# EAGLE design 3w-rgb-led-connector-mk-7.0 (EAGLE 6.5.0)
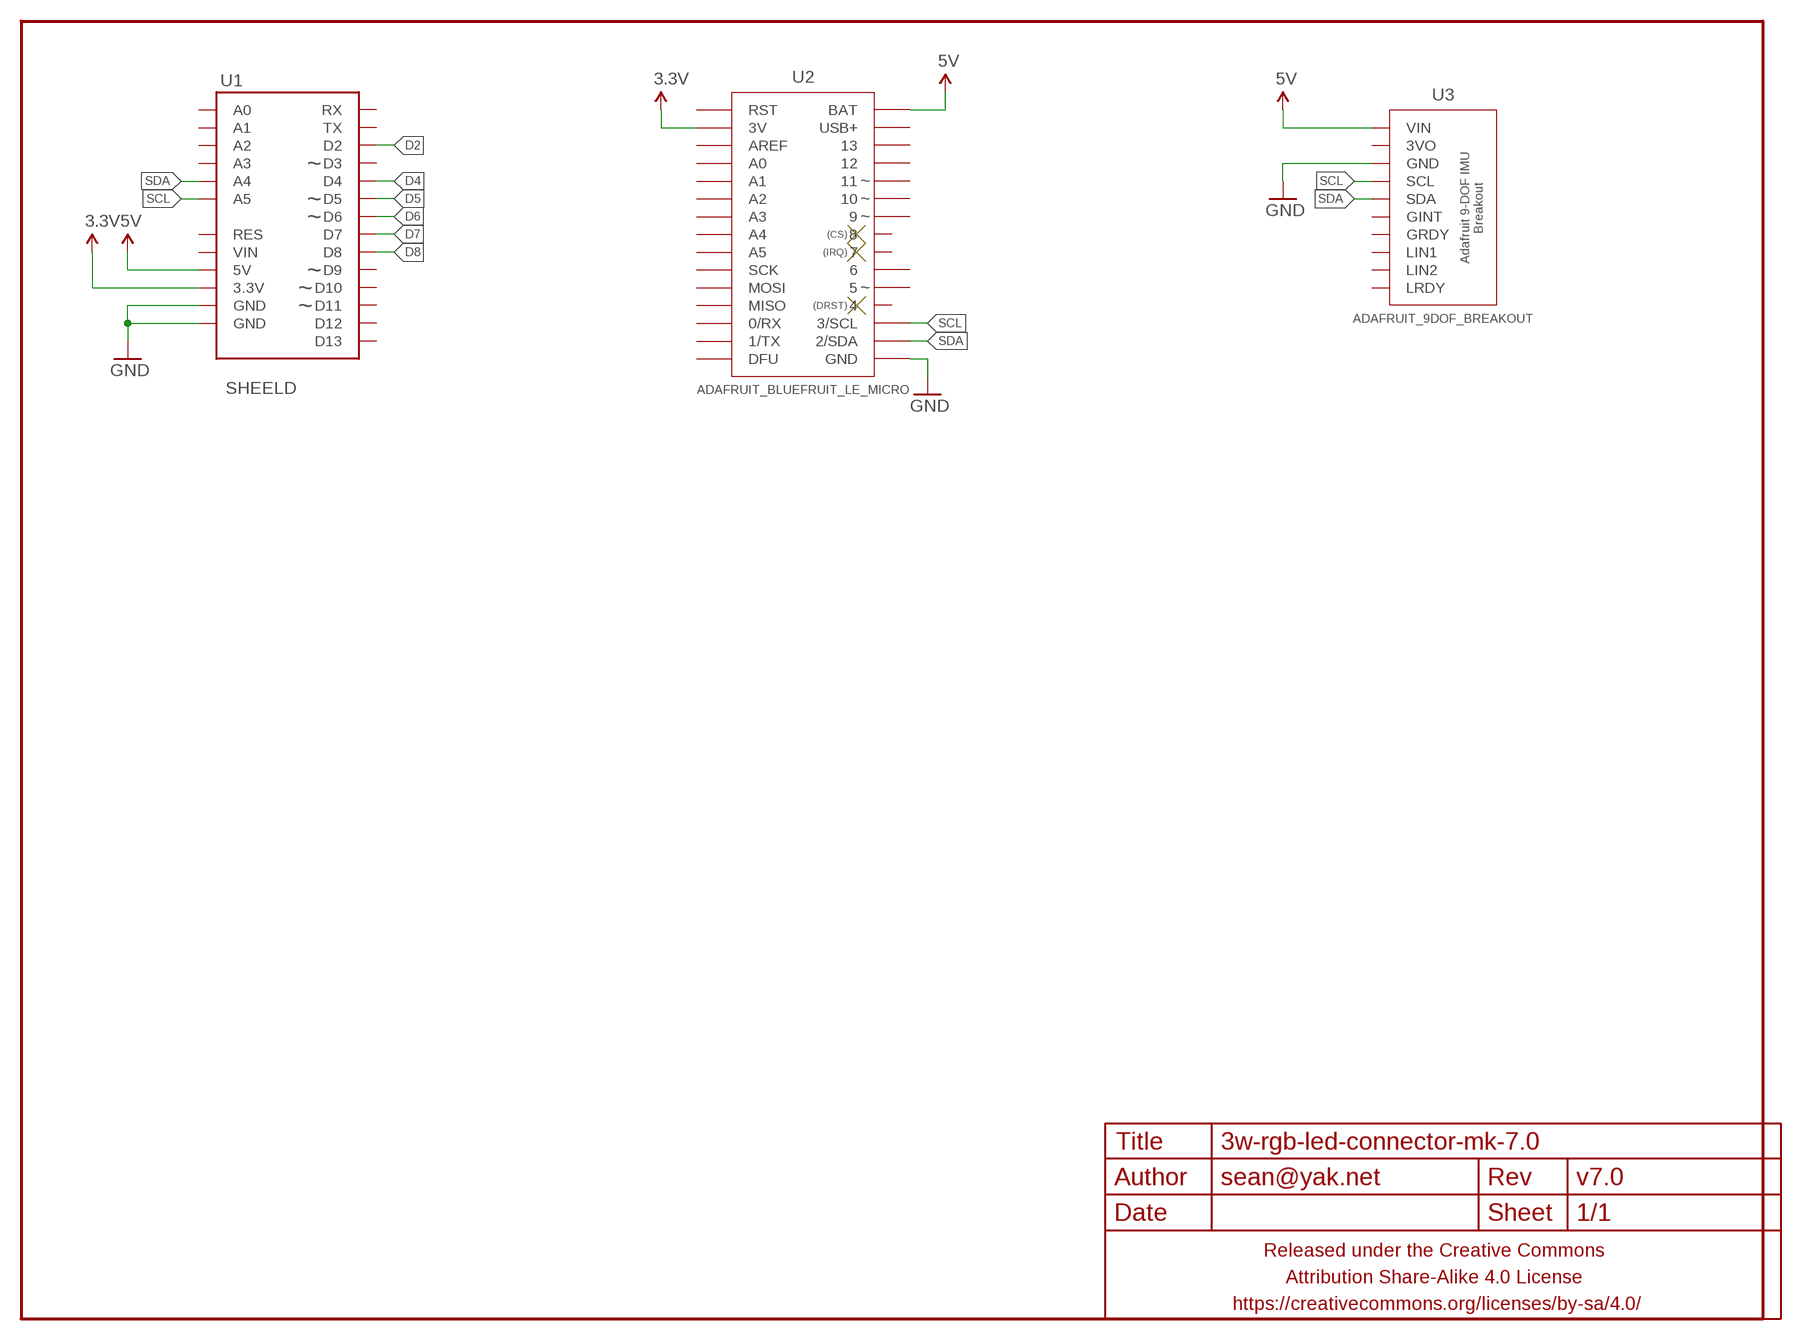
[diagram p0: schematic, sheet 1]

## Parts
FRAME1  FRAME-LETTERNO_PACKAGE  [DUMMY]
U1  SHEELD  ARDUINO_SHIELD_SMALLER  [ARDUINO_SHIELD_NOOUTLINE_INSIDE_SMALLER]
U2  ADAFRUIT_BLUEFRUIT_LE_MICRO  [ADAFRUIT_BLUEFRUIT_LE_MICRO]
U3  ADAFRUIT_9DOF_BREAKOUT  [ADAFRUIT_9DOF_BREAKOUT]

## Nets
3.3V: U1.3.3V U2.3V3(3V)
5V: U1.5V U2.BAT U3.VIN
D2: U1.D2
D4: U1.D4
D5: U1.D5
D6: U1.D6
D7: U1.D7
D8: U1.D8
GND: U1.GND@0(GND) U1.GND@1(GND) U2.GND@1(GND) U2.GND@2(GND) U2.GND@3(GND) U3.GND
SCL: U1.A5 U2.3/SCL U3.SCL
SDA: U1.A4 U2.2/SDA U3.SDA
Unconnected: U1.A0 U1.A1 U1.A2 U1.A3 U1.D3 U1.D9 U1.D10 U1.D11 U1.D12 U1.D13 U1.RES U1.RX U1.TX U1.VIN U2.0/RX U2.1/TX U2.4 U2.5 U2.6 U2.7 U2.8 U2.9 U2.10 U2.11 U2.12 U2.13 U2.A0 U2.A1 U2.A2 U2.A3 U2.A4 U2.A5 U2.AREF U2.DFU U2.MISO U2.MOSI U2.RST U2.SCK U2.USB(USB+) U3.3VO U3.GINT U3.GRDY U3.LIN1 U3.LIN2 U3.LRDY

## Library data of the parts
FRAME1 = A_butts:FRAME-LETTER: Schematic Frame Standard 8.5x11 US Letter frame; DESIGNER: sean@yak.net; VERSION: v7.0
U1 = A_butts:ARDUINO_SHIELD_SMALLER
U2 = A_butts:ADAFRUIT_BLUEFRUIT_LE_MICRO
U3 = A_butts:ADAFRUIT_9DOF_BREAKOUT

## Board
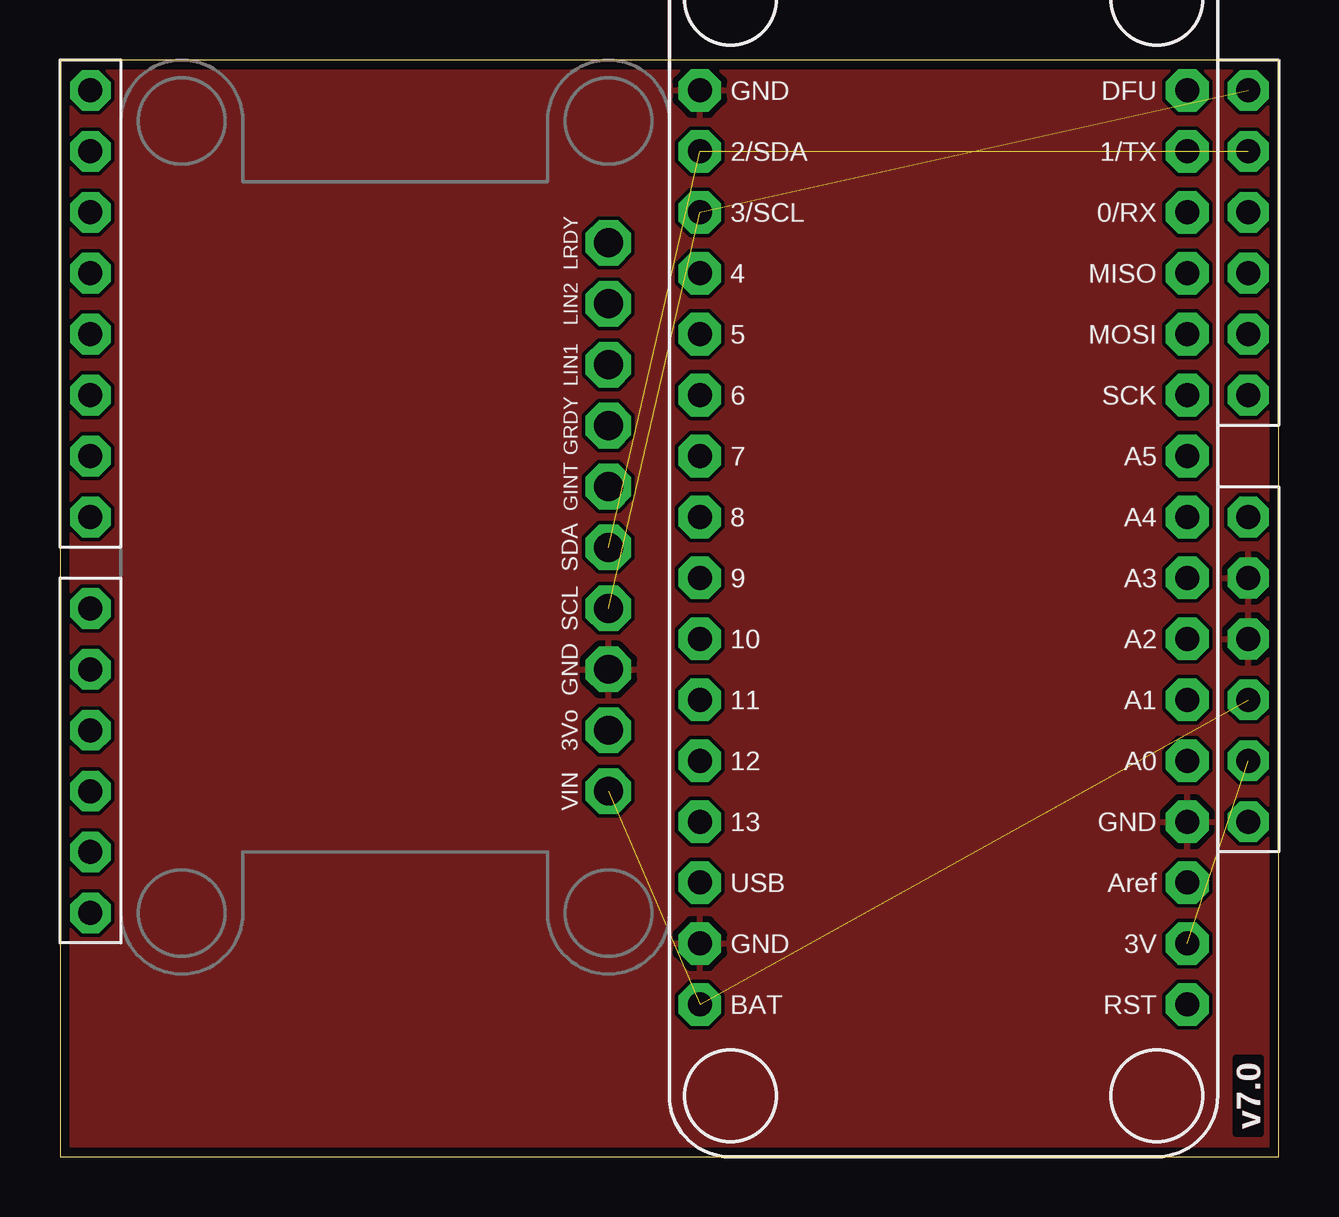
[diagram p1: board, top side]
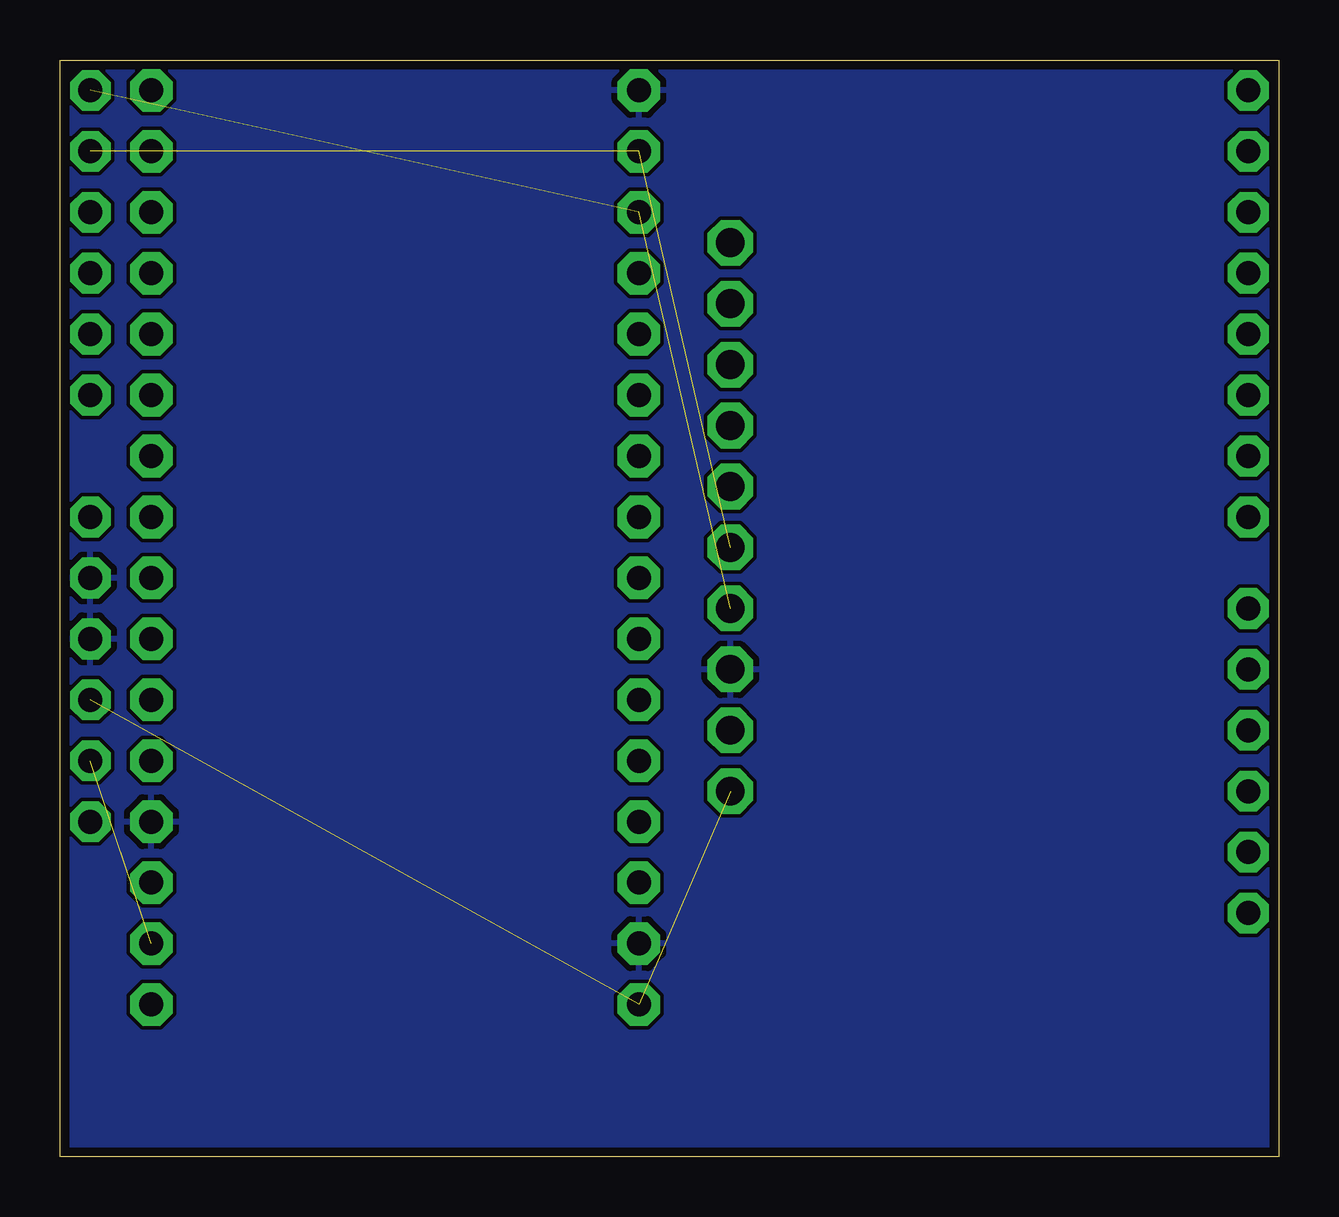
[diagram p2: board, bottom side, seen from below]

Size 50.8 x 45.72 mm. Coordinates in mm from the lower left corner, seen from the top.
Outline: 0,0 50.8,0 50.8,45.72 0,45.72 0,0
Copper layers (1*16): Top 0.0356mm / dielectric 1.5011mm / Bottom 0.0356mm
Design rules "LaenPCBOrder_2": minimum track width 6mil, minimum drill 13mil, track to track 6mil, track to pad 6mil, pad to pad 6mil, via to via 6mil, smd to smd 6mil, copper to edge 15mil, drill to drill 6mil, minimum pad ring 7mil, minimum via ring 7mil, stop-mask expansion 3mil, vias tented up to drill 20mil, thermal gap 10mil

### Footprints (pad centres in the part's own frame; a part is rotated, then mirrored left to right if it is on the bottom)
ARDUINO_SHIELD_NOOUTLINE_INSIDE_SMALLER = drill 1 pad 1.7 octagon: 3.3V 48.26,-27.94; 5V 48.26,-25.4; A0 48.26,-12.7; A1 48.26,-10.16; A2 48.26,-7.62; A3 48.26,-5.08; A4 48.26,-2.54; A5 48.26,0; D2 0,-5.08; D3 0,-7.62; D4 0,-10.16; D5 0,-12.7; D6 0,-15.24; D7 0,-17.78; D8 0,-21.59; D9 0,-24.13; D10 0,-26.67; D11 0,-29.21; D12 0,-31.75; D13 0,-34.29; GND@0 48.26,-22.86; GND@1 48.26,-20.32; RES 48.26,-30.48; RX 0,0; TX 0,-2.54; VIN 48.26,-17.78
ADAFRUIT_BLUEFRUIT_LE_MICRO = drill 1 pad 1.778 octagon: 0/RX 13.97,-10.16; 1/TX 16.51,-10.16; 2/SDA 16.51,10.16; 3/SCL 13.97,10.16; 3V3 -16.51,-10.16; 4 11.43,10.16; 5 8.89,10.16; 6 6.35,10.16; 7 3.81,10.16; 8 1.27,10.16; 9 -1.27,10.16; 10 -3.81,10.16; 11 -6.35,10.16; 12 -8.89,10.16; 13 -11.43,10.16; A0 -8.89,-10.16; A1 -6.35,-10.16; A2 -3.81,-10.16; A3 -1.27,-10.16; A4 1.27,-10.16; A5 3.81,-10.16; AREF -13.97,-10.16; BAT -19.05,10.16; DFU 19.05,-10.16; GND@1 -11.43,-10.16; GND@2 19.05,10.16; GND@3 -16.51,10.16; MISO 11.43,-10.16; MOSI 8.89,-10.16; RST -19.05,-10.16; SCK 6.35,-10.16; USB -13.97,10.16
ADAFRUIT_9DOF_BREAKOUT = drill 1.2 pad 1.9 octagon: 3VO -8.89,0; GINT 1.27,0; GND -6.35,0; GRDY 3.81,0; LIN1 6.35,0; LIN2 8.89,0; LRDY 11.43,0; SCL -3.81,0; SDA -1.27,0; VIN -11.43,0

### Placement (x,y rotation side)
FRAME1  0,0 0 top
U1  1.27,44.45 0 top
U2  36.83,25.4 90 top
U3  22.86,26.67 90 top

### Tracks (layer width: path | path; a pad name or v marks a point on that pad's centre or on a via)
3.3V  (1 unrouted)
5V  (2 unrouted)
GND
  pour Top (isolate 0.152): 0,45.72 50.8,45.72 50.8,0 0,0
  pour Bottom (isolate 0.152): 0,0 0,45.72 50.8,45.72 50.8,0
SCL  (2 unrouted)
SDA  (2 unrouted)

### Text on the board
tPlace: Das Blinkenskirt!